# Altium schematic sheet 4_STM32KIT_MCU.SchDoc
size 381 x 241 mm; SheetNumber: 3; SheetTotal: 4
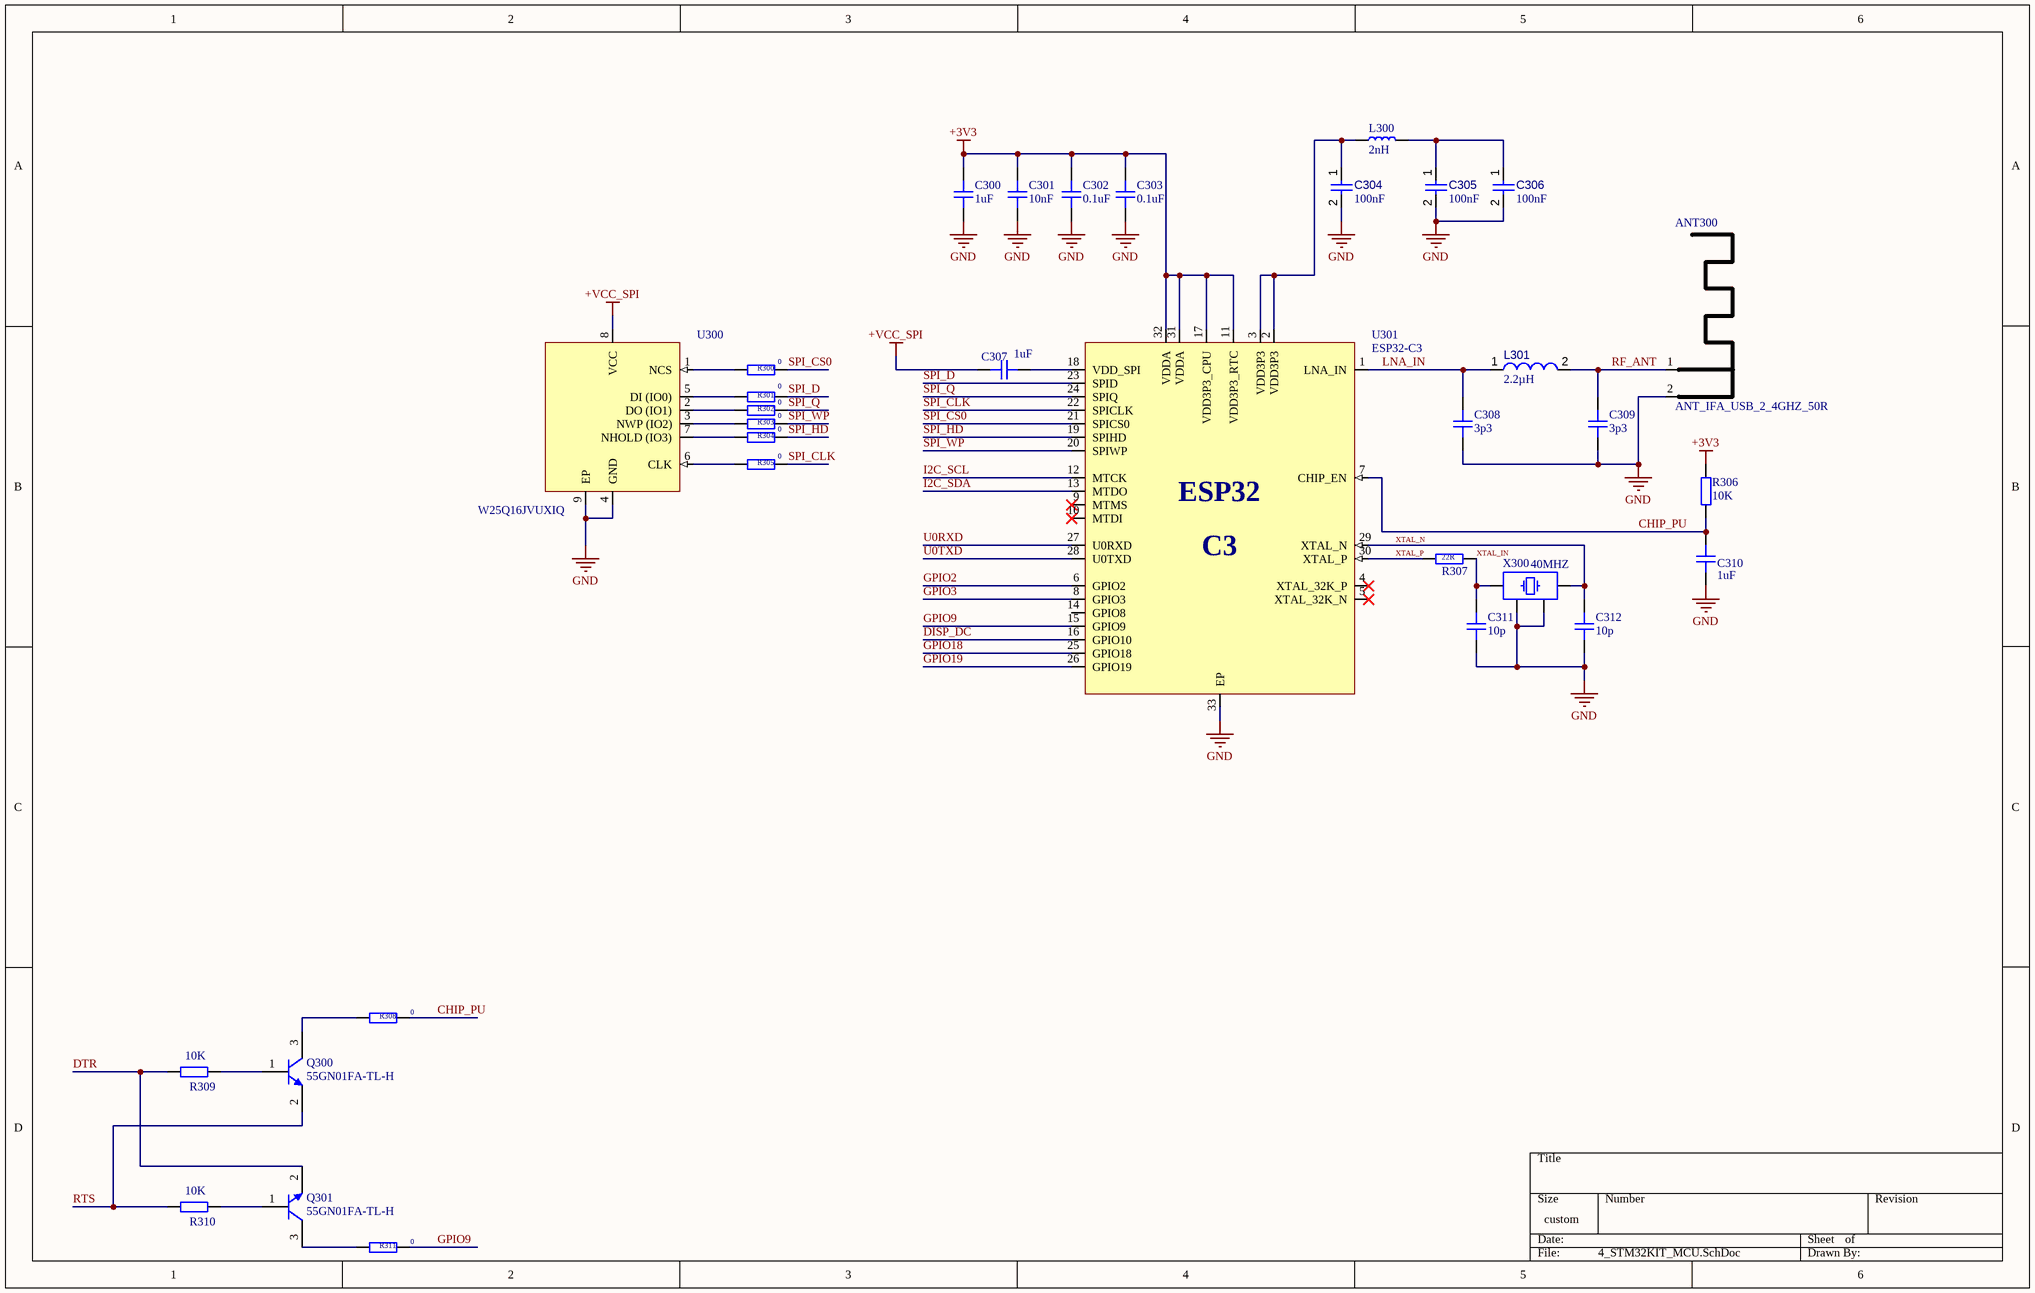
[diagram p0: 4_STM32KIT_MCU.SchDoc]

## Parts
ANT300  ANT_IFA_USB_2_4GHZ_50R  [ANT_IFA_USB_2_4GHZ_50R]  (no BOM)
C300  1uF  [CAP_0402]
C301  10nF  [CAP_0402]
C302  0.1uF  [CAP_0402]
C303  0.1uF  [CAP_0402]
C304  value 100nF  [CAPC1005X56X25LL10T15]  (hidden comment: Capacitor 0.1 uF +/- 5% 16 V 0402)
C305  value 100nF  [CAPC1005X56X25LL10T15]  (hidden comment: Capacitor 0.1 uF +/- 5% 16 V 0402)
C306  value 100nF  [CAPC1005X56X25LL10T15]  (hidden comment: 10u)
C307  1uF  [CAP_0402]
C308  3p3  [CAP_0402]
C309  3p3  [CAP_0402]
C310  1uF  [CAP_0402]
C311  10p  [CAP_0402]
C312  10p  [CAP_0402]
L300  2nH  [IND_0402]
L301  value 2.2µH  [IND1005X55X20VL5T10]  (hidden comment: ELJ-RF2N2DFB)
Q300  55GN01FA-TL-H  [ONSC-SSFP-3_V]
Q301  55GN01FA-TL-H  [ONSC-SSFP-3_V]
R300  0  [RES_0402]
R301  0  [RES_0402]
R302  0  [RES_0402]
R303  0  [RES_0402]
R304  0  [RES_0402]
R305  0  [RES_0402]
R306  10K  [RES_0402]
R307  22R  [RES_0402]
R308  0  [RES_0402]
R309  10K  [RES_0402]
R310  10K  [RES_0402]
R311  0  [RES_0402]
U300  W25Q16JVUXIQ  [USON-8-2X3MM]
U301  ESP32-C3  [QFN32-5X5]
X300  40MHZ  [XTAL_2520]

## Nets
+3V3: C300.2 C301.2 C302.2 C303.2 R306.2 U301.11(VDD3P3_RTC) U301.17(VDD3P3_CPU) U301.31(VDDA) U301.32(VDDA)
+VCC_SPI: C307.1 U300.8(VCC)
GND: ANT300.2(GND) C300.1 C301.1 C302.1 C303.1 C304.2 C305.2 C306.2 C308.1 C309.1 C310.1 C311.1 C312.1 U300.4(GND) U300.9(EP) U301.33(EP) X300.2 X300.4
CHIP_PU: C310.2 R306.1 R308.2 U301.7(CHIP_EN)
DISP_DC: U301.16(GPIO10)
DTR: Q301.2(E) R309.1
GPIO2: U301.6(GPIO2)
GPIO3: U301.8(GPIO3)
GPIO9: R311.2 U301.15(GPIO9)
GPIO18: U301.25(GPIO18)
GPIO19: U301.26(GPIO19)
I2C_SCL: U301.12(MTCK)
I2C_SDA: U301.13(MTDO)
LNA_IN: C308.2 L301.1 U301.1(LNA_IN)
RF_ANT: ANT300.1(RF) C309.2 L301.2
RTS: Q300.2(E) R310.1
SPI_CLK: R305.2 U301.22(SPICLK)
SPI_CS0: R300.2 U301.21(SPICS0)
SPI_D: R301.2 U301.23(SPID)
SPI_HD: R304.2 U301.19(SPIHD)
SPI_Q: R302.2 U301.24(SPIQ)
SPI_WP: R303.2 U301.20(SPIWP)
U0RXD: U301.27(U0RXD)
U0TXD: U301.28(U0TXD)
XTAL_IN: C311.2 R307.2 X300.1
XTAL_N: C312.2 U301.29(XTAL_N) X300.3
XTAL_P: R307.1 U301.30(XTAL_P)
NetC304_1: C304.1 L300.1 U301.2(VDD3P3) U301.3(VDD3P3)
NetC305_1: C305.1 C306.1 L300.2
NetC307_2: C307.2 U301.18(VDD_SPI)
NetQ300_1: Q300.1(B) R309.2
NetQ300_3: Q300.3(C) R308.1
NetQ301_1: Q301.1(B) R310.2
NetQ301_3: Q301.3(C) R311.1
NetR300_1: R300.1 U300.1(NCS)
NetR301_1: R301.1 U300.5(DI_(IO0))
NetR302_1: R302.1 U300.2(DO_(IO1))
NetR303_1: R303.1 U300.3(NWP_(IO2))
NetR304_1: R304.1 U300.7(NHOLD_(IO3))
NetR305_1: R305.1 U300.6(CLK)

Not connected (* = marked no-connect by the designer): U301 4(XTAL_32K_P)* 5(XTAL_32K_N)* 9(MTMS)* 10(MTDI)* 14(GPIO8)

## Notes on the sheet
- (in symbol CMP-028-000024-1) ESP32; C3

## Library data of the parts
ANT300 = CMP-028-000142-1: Inverted F 2.4GHz ISM PCB Antenna 50 Ohm; Design Item ID: ANT_IFA_USB_2_4GHZ_50R; ComponentLink1URL: https://www.ti.com/lit/an/swra117d/swra117d.pdf; ComponentLink1Description: Datasheet; Source: Schematic-Lib-PhilsLab.SchLib
C300-C303 = CAP_0402_50V: Capacitor SMD 0402 50V; Manufacturer: Samsung; Manufacturer Part Number: CL05B104KO5NNNC; LCSC: C1525
C304-C306 = CMP-001-00001-6: Chip Capacitor, 0.1 uF, +/- 5%, 16 V, 0402 (1005 Metric); Capacitor Type: Ceramic; Voltage Rating: 16V; Max Operating Temperature: 125°C; Min Operating Temperature: -55°C; Case/Package: 0402; Mounting Technology: SM; Pins: 2; Tolerance: 5%; RoHS Compliant: True
C307 C310 = CMP-001-00086-1: Capacitor SMD 0402; Manufacturer: *; Distributor Link: *; Manufacturer Part Number: *; Design Item ID: CAP_0402; Dielectric: *; LCSC: *; Source: Schematic-Lib-PhilsLab.SchLib; Rating: *
C308 C309 C311 C312 = CAP_0402: Capacitor SMD 0402; Manufacturer: *; Manufacturer Part Number: *; Distributor Link: *; LCSC: *; Rating: *; Dielectric: *
L300 = IND_0402: Inductor SMD 0402
L301 = CMP-006-00006-6: Chip Inductor, 2.2 nH, +/- 0.3 nH, 400 mA, -40 to 85 degC, 0402 (1005 Metric), RoHS, Tape and Reel; Manufacturer: Panasonic; Shielding: Unshielded; Current Rating: 400mA; Tolerance: 5%; Core Material: Ceramic; Q Factor: 8; Datasheet URL: http://www.bourns.com/docs/Product-Datasheets/cm322522.pdf; Case/Package: 0402; RoHS Compliant: True; Package Description: 2-Pin Surface Mount Device, Body 1 x 0.5 mm; Packaging: TapeandReel; Datasheet Version: Sep-12; Package Quantity: 10000; Package Reference: 0402; Min Operating Temperature: -20°C; Mounting Technology: SM; Max Operating Temperature: 85°C
Q300 Q301 = CMP-1030-00012-1: RF Transistor, 10 V, 70 mA, fT=5.5 GHz, NPN Single, 3-Pin SSFP, Pb-Free, Tape and Reel; Manufacturer: On Semiconductor; fT Min (MHz): 3000; IC Continuous (A): 0.07; hFE Max: 160; ComponentLink1Description: Manufacturer URL; ComponentLink2Description: Datasheet; Packing: Tape and Reel; ComponentLink1URL: http://www.onsemi.com/; Mounting Technology: Surface Mount; ComponentLink3Description: Package Specification; PackageDescription: 3-Pin Small Outline Transistor, Body 1.4 x 0.8 mm, Pitch 0.45 mm; PartNumber: 55GN01FA-TL-H; ComponentLink2URL: http://www.onsemi.com/pub_link/Collateral/55GN01FA.PDF; RoHS: TRUE; PackageReference: SSFP-3; Polarity: NPN; ComponentLink3URL: http://www.onsemi.com/pub_link/Collateral/55GN01FA.PDF
R300-R311 = CMP-009-00182-1: Resistor SMD 0402; Distributor Link: *; Source: Schematic-Lib-PhilsLab.SchLib; Manufacturer Part Number: *; LCSC: *; Design Item ID: RES_0402; Manufacturer: *
U300 = CMP-031-00020-1: 16M-BIT SERIAL FLASH MEMORY WITH DUAL/QUAD SPI USON-8; Manufacturer: Winbond; Design Item ID: W25Q16JVUXIQ; Source: Schematic-Lib-PhilsLab.SchLib; LCSC: C2843335; Manufacturer Part Number: W25Q16JVUXIQ
U301 = CMP-028-000024-1: Ultra­Low­Power SoC with RISC­V Single­Core CPU Supporting IEEE 802.11b/g/n (2.4 GHz Wi­Fi) and Bluetooth® 5 (LE); Manufacturer: Espressif; Source: Schematic-Lib-PhilsLab.SchLib; Manufacturer Part Number: ESP32-C3; Design Item ID: ESP32-C3; LCSC: C2838500
X300 = XTAL_2520: Crystal SMD 2520; Distributor Link: *